# Altium schematic sheet Sheet1_WATERALARM.SchDoc
size A4; Engineer: Burak YALIM; SheetNumber: 1; SheetTotal: 1
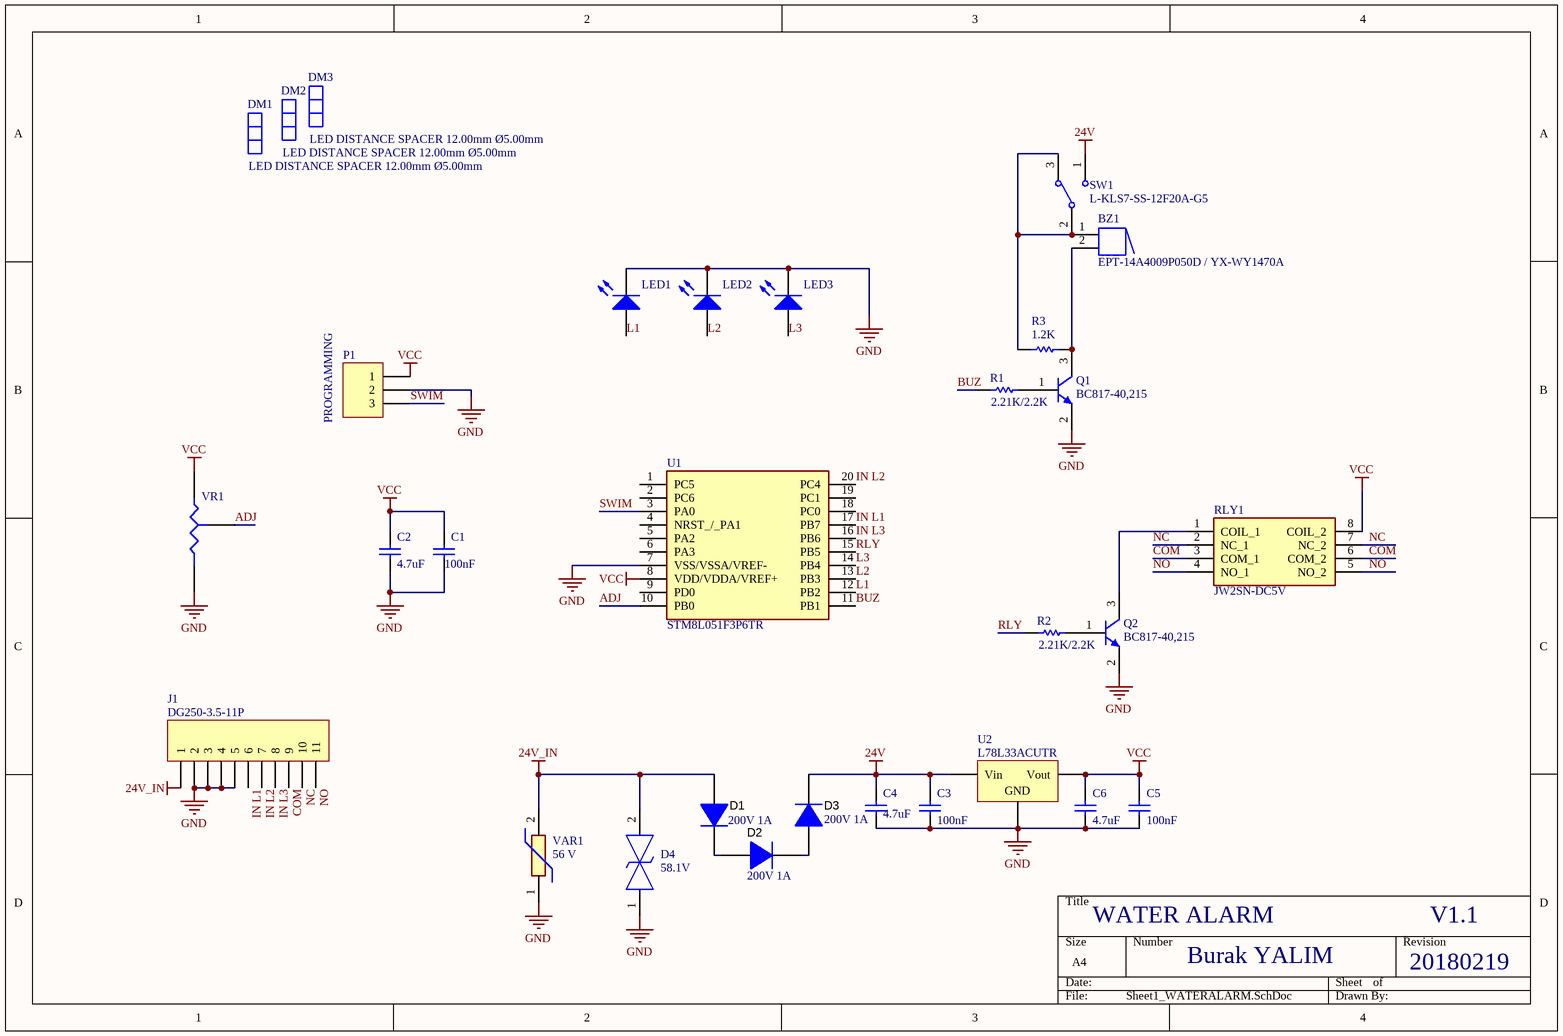
[diagram p0: Sheet1_WATERALARM.SchDoc]

## Parts
BZ1  EPT-14A4009P050D / YX-WY1470A  [piezo buzzer]
C1  value 100nF  [C0805-N]  (hidden comment: CL21B104KBCNNNL)
C2  value 4.7uF  [C0805-N]  (hidden comment: CL21A475KBQNNNE)
C3  value 100nF  [C0805-N]  (hidden comment: CL21B104KBCNNNL)
C4  value 4.7uF  [C0805-N]  (hidden comment: CL21A475KBQNNNE)
C5  value 100nF  [C0805-N]  (hidden comment: CL21B104KBCNNNL)
C6  value 4.7uF  [C0805-N]  (hidden comment: CL21A475KBQNNNE)
D1  value 200V 1A  [SMA]  (hidden comment: US1D_R1_00001 / US1D-SMA-MDD)
D2  value 200V 1A  [SMA]  (hidden comment: US1D_R1_00001 / US1D-SMA-MDD)
D3  value 200V 1A  [SMA]  (hidden comment: US1D_R1_00001 / US1D-SMA-MDD)
D4  value 58.1V  [DIONM5127X250N]  (hidden comment: SMAJ36CA/TR7 / SMAJ36CA-UMW)
DM1  value LED DISTANCE SPACER 12.00mm Ø5.00mm  (hidden comment: L-KLS8-0108-LED-12)  (mechanical)
DM2  value LED DISTANCE SPACER 12.00mm Ø5.00mm  (hidden comment: L-KLS8-0108-LED-12)  (mechanical)
DM3  value LED DISTANCE SPACER 12.00mm Ø5.00mm  (hidden comment: L-KLS8-0108-LED-12)  (mechanical)
J1  DG250-3.5-11P  [11 pin Terminal sping loaded]
LED1  3R4HD-7-TB  [led 3mm]  (value not drawn)
LED2  3R4HD-7-TB  [led 3mm]  (value not drawn)
LED3  3R4HD-7-TB  [led 3mm]  (value not drawn)
P1  PROGRAMMING  [HDR1X3]  (no BOM)
Q1  BC817-40,215  [SOT-23]
Q2  BC817-40,215  [SOT-23]
R1  value 2.21K/2.2K  [C0805-N]  (hidden comment: 0805S8F2211T5E/0805S8J0222T5E)
R2  value 2.21K/2.2K  [C0805-N]  (hidden comment: 0805S8F2211T5E/0805S8J0222T5E)
R3  value 1.2K  [C1210]  (hidden comment: RI1210L122JT)
RLY1  JW2SN-DC5V  [JW2SNDC5V]
SW1  L-KLS7-SS-12F20A-G5  [Slide Switch]
U1  STM8L051F3P6TR  [SOP65P640X120-20N]
U2  L78L33ACUTR  [SOT89M]
VAR1  Varistor Voltage: 56 V  [ERZV05D180]  (hidden comment: TVR07470KSY)
VR1  L-KLS4-WH06-2A-103  [Potentiometer]  (value not drawn)

## Nets
24V: C3.2 C4.2 D3.1(K) SW1.1 U2.1(Vin)
24V_IN: D1.2(A) D4.2 J1.1 VAR1.2
GND: C1.1 C2.1 C3.1 C4.1 C5.1 C6.1 D4.1 J1.2 J1.3 J1.4 J1.5 LED1.2(K) LED2.2(K) LED3.2(K) P1.2 Q1.2(E) Q2.2(E) U1.7(VSS/VSSA/VREF-) U2.2(GND) VAR1.1 VR1.2(B)
VCC: C1.2 C2.2 C5.2 C6.2 P1.1 RLY1.8(COIL_2) U1.8(VDD/VDDA/VREF+) U2.3(Vout) VR1.1(A)
ADJ: U1.10(PB0) VR1.3(TAP)
BUZ: R1.2 U1.11(PB1)
COM: J1.9 RLY1.3(COM_1) RLY1.6(COM_2)
IN L1: J1.6 U1.17(PB7)
IN L2: J1.7 U1.20(PC4)
IN L3: J1.8 U1.16(PB6)
L1: LED1.1(A) U1.12(PB2)
L2: LED2.1(A) U1.13(PB3)
L3: LED3.1(A) U1.14(PB4)
NC: J1.10 RLY1.2(NC_1) RLY1.7(NC_2)
NO: J1.11 RLY1.4(NO_1) RLY1.5(NO_2)
RLY: R2.2 U1.15(PB5)
SWIM: P1.3 U1.3(PA0)
NetBZ1_1: BZ1.1 R3.2 SW1.2 SW1.3
NetBZ1_2: BZ1.2 Q1.3(C) R3.1
NetD1_1: D1.1(K) D2.2(A)
NetD2_1: D2.1(K) D3.2(A)
NetQ1_1: Q1.1(B) R1.1
NetQ2_1: Q2.1(B) R2.1
NetQ2_3: Q2.3(C) RLY1.1(COIL_1)

Not connected (* = marked no-connect by the designer): U1 1(PC5) 2(PC6) 4(NRST_/_PA1) 5(PA2) 6(PA3) 9(PD0) 18(PC0) 19(PC1)

## Notes on the sheet
- WATER ALARM
- V1.1
- Burak YALIM
- 20180219

## Library data of the parts
BZ1 = Buzzer: BUZZER PIEZO W/O CIRCUIT 9V 4-KHZ THT; Manufacturer: SANCO / YXDZ; Manufacturer Part Number: EPT-14A4009P050D / YX-WY1470A
C1 C3 C5 = Cap: MLCC (2012) 0805 100nF 50VDC ±10% X7R; Manufacturer: SAMSUNG; Manufacturer Part Number: CL21B104KBCNNNL
C2 C4 C6 = Cap: MLCC (2012) 0805 4.7uF 50VDC ±10% X5R; Manufacturer: SAMSUNG; Manufacturer Part Number: CL21A475KBQNNNE
D1-D3 = MURA160T3G: DIODE U.FAST SINGLE 1A 200V DO214AC (SMA) SMT; Manufacturer: ON Semiconductor /  MDD(Microdiode Semiconductor); Manufacturer Part Number: US1D_R1_00001 / US1D-SMA-MDD; ComponentLink1Description: Datasheet link; ComponentLink1URL: http://www.onsemi.com/pub_link/Collateral/MURA160T3-D.PDF
D4 = SMAJ36CA-AT_TR7: 58.1V Clamp 6.9A Ipp Tvs Diode Surface Mount DO-214AC (SMA); Manufacturer: YAGEO / MDD(Microdiode Semiconductor); Manufacturer Part Number: SMAJ36CA/TR7 / SMAJ36CA-UMW
DM1-DM3 = DISTANCE 11MM M3: LED DISTANCE SPACER 12.00mm NONE Ø5.00mm; Manufacturer: KLS ELECTRONIC; Manufacturer Part Number: L-KLS8-0108-LED-12
J1 = DG250-3.5-11P: TERM.BLK.3.50MM 11P PCB TYPE GRAY GAOSONG; Manufacturer: DEGSON/GAOSONG; Manufacturer Part Number: DG250-3.5-11P; Value: DG250-3.5-11P
LED1-LED3 = LED2: LED 3MM RED 30mcd 35° RED/DIFFUSED; Manufacturer: STRONG BASE; Manufacturer Part Number: 3R4HD-7-TB
P1 = Header 3: Header, 3-Pin
Q1 Q2 = NPN: TRANSISTOR DIS.500mA 45V NPN SOT23 GEN. SMT; Manufacturer: NXP; Manufacturer Part Number: BC817-40,215
R1 R2 = Res1: RES.(2012) 0805 2.21K/2.2K Ohms 1%/5% 1/8W-S 100PPM; Manufacturer: ROYALOHM; Manufacturer Part Number: 0805S8F2211T5E/0805S8J0222T5E
R3 = Res1: RES.(3225) 1210 1.2K Ohms 5% 1/2W 200PPM; Manufacturer: HOTTECH; Manufacturer Part Number: RI1210L122JT
RLY1 = JW2SN-DC5V: General Purpose Relay DPDT (2 Form C) 5VDC Coil Through Hole; Manufacturer: Panasonic; Manufacturer Part Number: JW2SN-DC5V
SW1 = SW-SPDT: SWITCH SLIDE 1P2T 500mA 50V On-On THT V/T; Manufacturer: KLS ELECTRONIC; Manufacturer Part Number: L-KLS7-SS-12F20A-G5
U1 = STM8L051F3P6TR: IC-8L051 MCU 8BIT 8K FLASH TSSOP20; Manufacturer: STMicroelectronics; Datasheet Link: https://www.st.com/resource/en/datasheet/stm8l051f3.pdf; Height: 1.2mm; Manufacturer Part Number: STM8L051F3P6TR; Mouser Part Number: 511-STM8L051F3P6TR; Mouser Price/Stock: https://www.mouser.co.uk/ProductDetail/STMicroelectronics/STM8L051F3P6TR?qs=jgnmLK5BaiFksEdVQwFp7A%3D%3D; Arrow Part Number: STM8L051F3P6TR; Arrow Price/Stock: https://www.arrow.com/en/products/stm8l051f3p6tr/stmicroelectronics?utm_currency=USD&region=nac
U2 = Volt Reg: IC-78L33 VOLTAGE REGULATOR 3.3V 100mA SOT89 ST; Manufacturer: STM; Manufacturer Part Number: L78L33ACUTR; Value: L78L33ACUTR
VAR1 = ERZ-V05D180: VARISTOR DISC 7MM 47V 250A 30VAC 38VDC THT; Manufacturer: THINKING; Manufacturer Part Number: TVR07470KSY; Value: TVR07470KSY
VR1 = Res Tap: TRIMPOT CARBON V 6MM 10K; Manufacturer: KLS ELECTRONIC; Manufacturer Part Number: L-KLS4-WH06-2A-103; Value: 10K